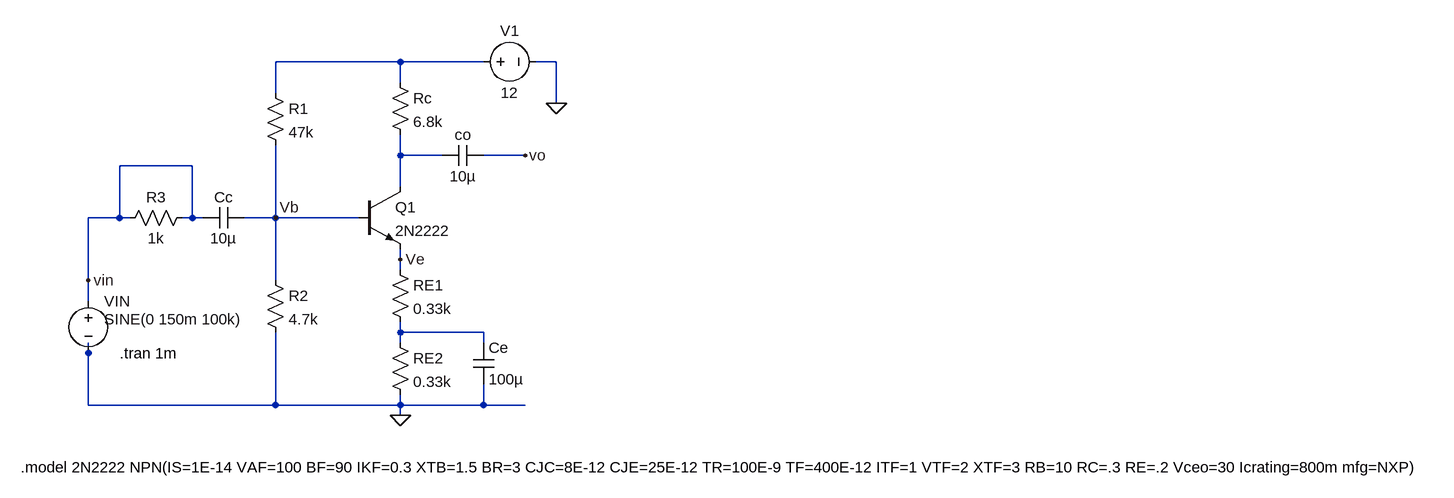
[diagram p0: schematic ce3.asc]
ce3.asc, the LTspice schematic file:
Version 4
SHEET 1 2116 680
WIRE 208 -144 16 -144
WIRE 336 -144 208 -144
WIRE 448 -144 416 -144
WIRE 208 -112 208 -144
WIRE 16 -96 16 -144
WIRE 448 -80 448 -144
WIRE 208 0 208 -32
WIRE 272 0 208 0
WIRE 400 0 336 0
WIRE -112 16 -224 16
WIRE 208 48 208 0
WIRE -224 96 -224 16
WIRE -224 96 -272 96
WIRE -208 96 -224 96
WIRE -112 96 -112 16
WIRE -112 96 -128 96
WIRE -96 96 -112 96
WIRE 16 96 16 -16
WIRE 16 96 -32 96
WIRE 144 96 16 96
WIRE 208 160 208 144
WIRE 208 176 208 160
WIRE -272 192 -272 96
WIRE 16 192 16 96
WIRE -272 224 -272 192
WIRE 208 272 208 256
WIRE 336 272 208 272
WIRE 208 288 208 272
WIRE 336 288 336 272
WIRE -272 304 -272 288
WIRE -272 384 -272 304
WIRE 16 384 16 272
WIRE 16 384 -272 384
WIRE 208 384 208 368
WIRE 208 384 16 384
WIRE 336 384 336 352
WIRE 336 384 208 384
WIRE 400 384 336 384
WIRE 208 400 208 384
FLAG 208 400 0
FLAG 16 96 Vb
FLAG 208 160 Ve
FLAG 448 -80 0
FLAG 400 0 vo
FLAG -272 192 vin
SYMBOL npn 144 48 R0
SYMATTR InstName Q1
SYMATTR Value 2N2222
SYMBOL res 192 -128 R0
SYMATTR InstName Rc
SYMATTR Value 6.8k
SYMBOL res 192 160 R0
SYMATTR InstName RE1
SYMATTR Value 0.33k
SYMBOL res 192 272 R0
SYMATTR InstName RE2
SYMATTR Value 0.33k
SYMBOL res 0 -112 R0
SYMATTR InstName R1
SYMATTR Value 47k
SYMBOL res 0 176 R0
SYMATTR InstName R2
SYMATTR Value 4.7k
SYMBOL voltage 320 -144 R270
WINDOW 0 32 56 VTop 2
WINDOW 3 -32 56 VBottom 2
WINDOW 123 0 0 Left 0
WINDOW 39 0 0 Left 0
SYMATTR InstName V1
SYMATTR Value 12
SYMBOL voltage -272 208 R0
WINDOW 123 24 44 Left 2
WINDOW 39 0 0 Left 0
WINDOW 3 24 44 Left 2
SYMATTR Value SINE(0 150m 100k)
SYMATTR InstName VIN
SYMBOL cap 336 -16 R90
WINDOW 0 0 32 VBottom 2
WINDOW 3 32 32 VTop 2
SYMATTR InstName co
SYMATTR Value 10µ
SYMBOL res -112 80 R90
WINDOW 0 0 56 VBottom 2
WINDOW 3 32 56 VTop 2
SYMATTR InstName R3
SYMATTR Value 1k
SYMBOL cap -32 80 R90
WINDOW 0 0 32 VBottom 2
WINDOW 3 32 32 VTop 2
SYMATTR InstName Cc
SYMATTR Value 10µ
SYMBOL cap 320 288 R0
SYMATTR InstName Ce
SYMATTR Value 100µ
TEXT -376 480 Left 2 !.model 2N2222 NPN(IS=1E-14 VAF=100 BF=90 IKF=0.3 XTB=1.5 BR=3 CJC=8E-12 CJE=25E-12 TR=100E-9 TF=400E-12 ITF=1 VTF=2 XTF=3 RB=10 RC=.3 RE=.2 Vceo=30 Icrating=800m mfg=NXP)
TEXT -224 304 Left 2 !.tran 1m

The netlist it stands for:
* ce3.asc
Q1 N002 Vb Ve 0 2N2222
Rc N001 N002 6.8k
RE1 Ve N003 0.33k
RE2 N003 0 0.33k
R1 N001 Vb 47k
R2 Vb 0 4.7k
V1 N001 0 12
VIN vin 0 SINE(0 150m 100k)
co vo N002 10µ
R3 vin vin 1k
Cc Vb vin 10µ
Ce N003 0 100µ
.model NPN NPN
.model PNP PNP
.lib standard.bjt
.model 2N2222 NPN(IS=1E-14 VAF=100 BF=90 IKF=0.3 XTB=1.5 BR=3 CJC=8E-12 CJE=25E-12 TR=100E-9 TF=400E-12 ITF=1 VTF=2 XTF=3 RB=10 RC=.3 RE=.2 Vceo=30 Icrating=800m mfg=NXP)
.tran 1m
.backanno
.end